# Altium schematic sheet OutputDriver.SchDoc: Title
size 396 x 279 mm; PageSetup: Record=PageOptions|CenterHorizontal=True|CenterVertical=True|PrintScale=1.00|XCorrection=1.00|YCorrection=1.00|PrintKind=0|BorderSize=5000000|LeftOffset=0|BottomOffset=0|Orientation=2|PaperLength=1000|PaperWidth=1000|Scale=100|PaperSource=7|PrintQuality=-4|MediaType=1|DitherType=10|PaperKind=A3|PrintScaleMode=0
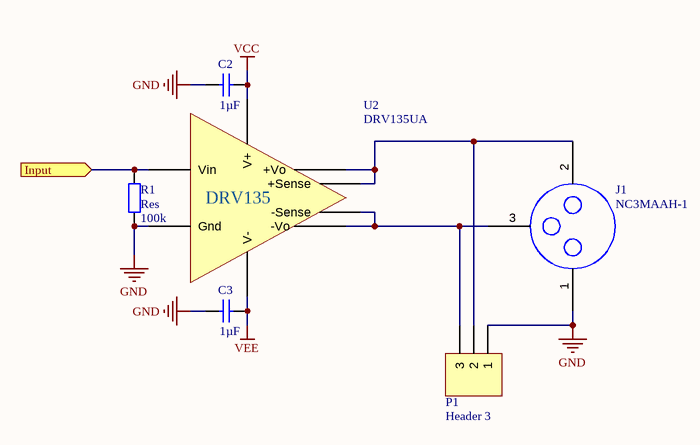
[diagram p0: OutputDriver.SchDoc]

## Parts
C2  value 1µF  [CAPC3225N]  (hidden comment: Cap)
C3  value 1µF  [CAPC3225N]  (hidden comment: Cap)
J1  NC3MAAH-1  [NC3MAAH-1]
P1  Header 3  [MTA-100-3P]
R1  Res  value 100k  [RESC1005X40X25NL05T05]
U2  DRV135UA  [SOIC127P600X360-8N]

## Ports
Input (in)

## Nets
GND: C2.1 C3.1 J1.1 P1.1 R1.1 U2.3(Gnd)
VCC: C2.2 U2.6(V+)
VEE: C3.2 U2.5(V-)
Input: R1.2 U2.4(Vin) ; port Input
NetJ1_2: J1.2 P1.2 U2.7(+Sense) U2.8(+Vo)
NetJ1_3: J1.3 P1.3 U2.1(-Vo) U2.2(-Sense)

## Notes on the sheet
- A
- B
- C
- D
- E
- F
- 1
- 2
- 3
- ZENITEL reserves the right to
- In the interest of product improvement,
- to a third person without our written consent.
- and must not be copied or shown
- This document is property of ZENITEL
- 4
- TITLE:
- REV No.
- ISSUE DATE
- REASON FOR ISSUE
- PREPARED
- CHECKED
- APPROVED
- DOC No:
- -CD
- alter specification and design without notice.
- PAGE No:
- of
- PAGE:
- FILE:
- (in symbol CMP-IC-00071-3) DRV135

## Library data of the parts
C2 C3 = CMP-CAP-00478-3: Chip cap 1uF 50v X7R 1210; Zenitel PartNumber: 4000084277; Tolerance: 10%; Capacitor Type: Ceramic; Case/Package: 1210; Dielectric: X7R; Voltage: 50V; Mount: SMD
J1 = CMP-CON-00332-1: NC3MAAH-1 3pole male XLR 90deg; Zenitel PartNumber: 4000083185; Mount: HOLE
P1 = CMP-CON-00453-1: MTA-100-3P 3-pin header; Zenitel PartNumber: 4000085467; Rows: 1; Angle: Straight; Pitch: 2.54mm; Type: MTA header; Series: MTA; Pins: 3
R1 = CMP-RES-00067-4: Chip resistor 100K - 0402; Zenitel PartNumber: 4000081112; Power: 62.5mW; Tolerance: 1%; Voltage: 50V; Case/Package: 0402; Pins: 2; RoHS: Yes; Mount: SMD
U2 = CMP-IC-00071-3: Audio Amplifiers AUDIO LINE DRIVERS; Min Supply Voltage: 4.5V; Input Offset Voltage (Vos): 10mV; Quiescent Current: 5.2mA; Gain: 6dB; Interface: Analog; Common Mode Rejection Ratio: 46dB; Max Supply Voltage: 18V; Power Supply Rejection Ratio (PSRR): 80dB; Number of Elements: 3; Number of Channels: 1; Differential Output: Yes; Slew Rate: 15V/µs; Input Resistance: 10kR; Packaging: Rail/Tube; Mount: Surface Mount; Contact Plating: Gold; Number of Pins: 8; Package Quantity: 75; Max Operating Temperature: 125°C; Width: 3.91mm; Weight: 0.002677oz; RoHS: Yes; Number of Terminals: 8; Voltage: 18V; Lead Free: Lead Free; Max Dual Supply Voltage: 18V; Nominal Supply Current: 5.2mA; Case/Package: SOIC; Min Dual Supply Voltage: 4.5V; Min Operating Temperature: -55°C; Radiation Hardening: No; Voltage Gain: 6dB; Height: 1.58mm; REACH SVHC: No SVHC; Length: 4.9mm